# Altium project Sonar_Rev2.PrjPCB
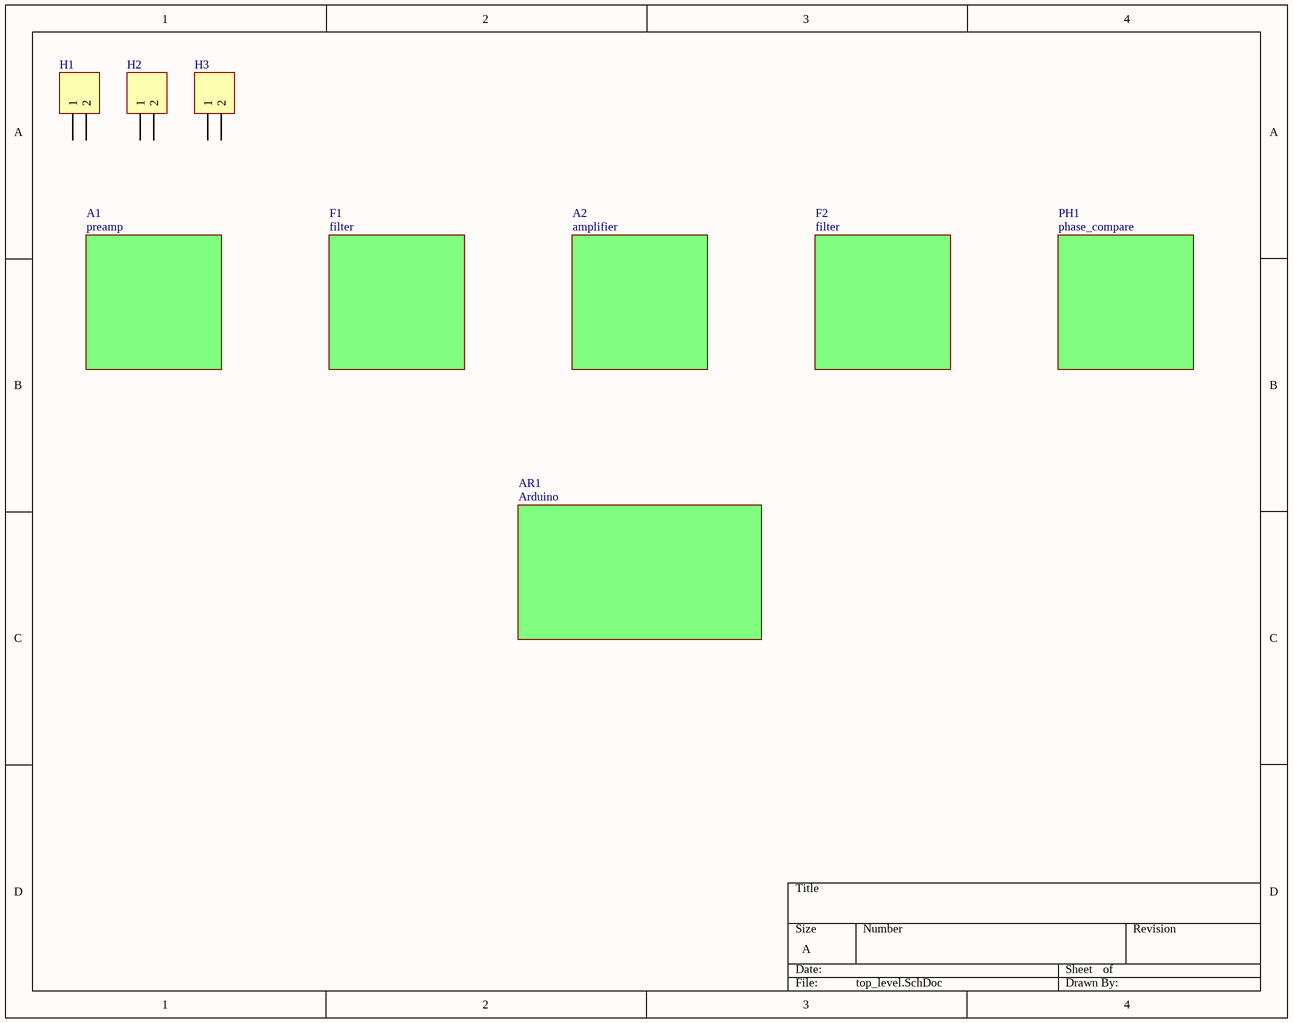
[diagram p0: top_level.SchDoc]
6 sheets, 19 parts. Net scope: global (net labels, ports and power ports of the same name join across sheets).
Board file: sonar_rev2.PcbDoc
Sheets:
  top_level.SchDoc
    A1 = preamp.SchDoc
    F1 = filter.SchDoc
    A2 = amplifier.SchDoc
    F2 = filter.SchDoc
    PH1 = phase_compare.SchDoc
    AR1 = Arduino.SchDoc

## Sheet top_level.SchDoc
size A

### Parts
H1  Header 2  [HDR1X2]  (value not drawn)
H2  Header 2  [HDR1X2]  (value not drawn)
H3  Header 2  [HDR1X2]  (value not drawn)

### Sub-sheets
A1 = preamp: no entries
A2 = amplifier: no entries
AR1 = Arduino: no entries
F1 = filter: no entries
F2 = filter: no entries
PH1 = phase_compare: no entries

### Nets

Not connected (* = marked no-connect by the designer): H1 1 2; H2 1 2; H3 1 2

### Library data of the parts
H1-H3 = Header 2: Header, 2-Pin; LatestRevisionDate: 17-Jul-2002; LatestRevisionNote: Re-released for DXP Platform.; Publisher: Altium Limited

## Sheet preamp.SchDoc
size A
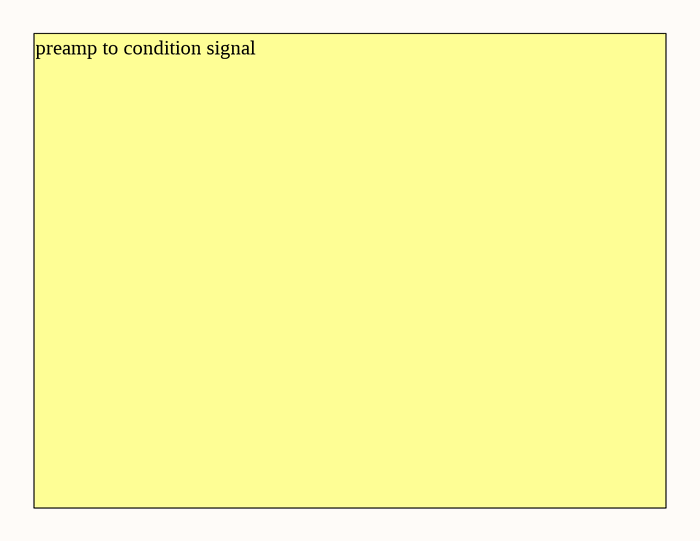
[diagram p1: preamp.SchDoc]

### Notes on the sheet
- preamp to condition signal

## Sheet filter.SchDoc
size A
Used 2 times, as channels F1, F2. Parts and nets are listed once, with the designators drawn on the sheet.
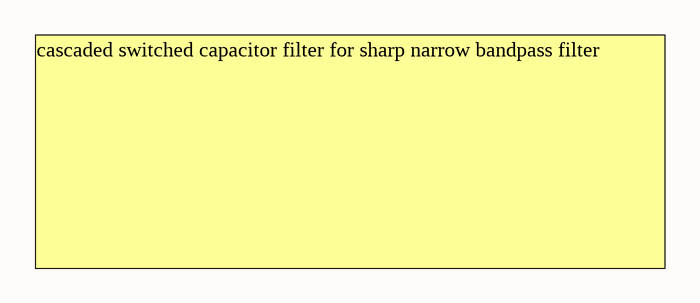
[diagram p2: filter.SchDoc]

### Channels
F1: no parts or ports
F2: no parts or ports

### Notes on the sheet
- cascaded switched capacitor filter for sharp narrow bandpass filter

## Sheet amplifier.SchDoc
size A
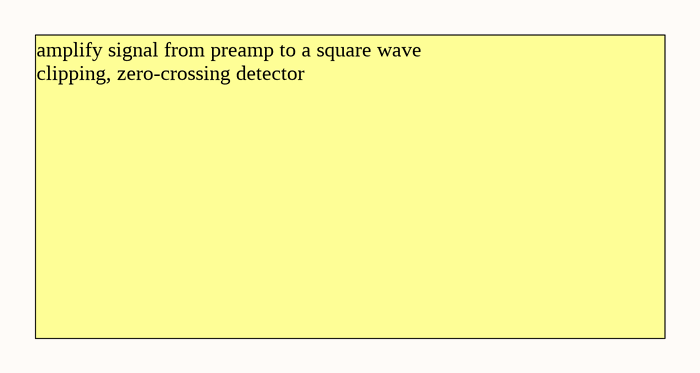
[diagram p3: amplifier.SchDoc]

### Notes on the sheet
- amplify signal from preamp to a square wave
  clipping, zero-crossing detector

## Sheet phase_compare.SchDoc
size A
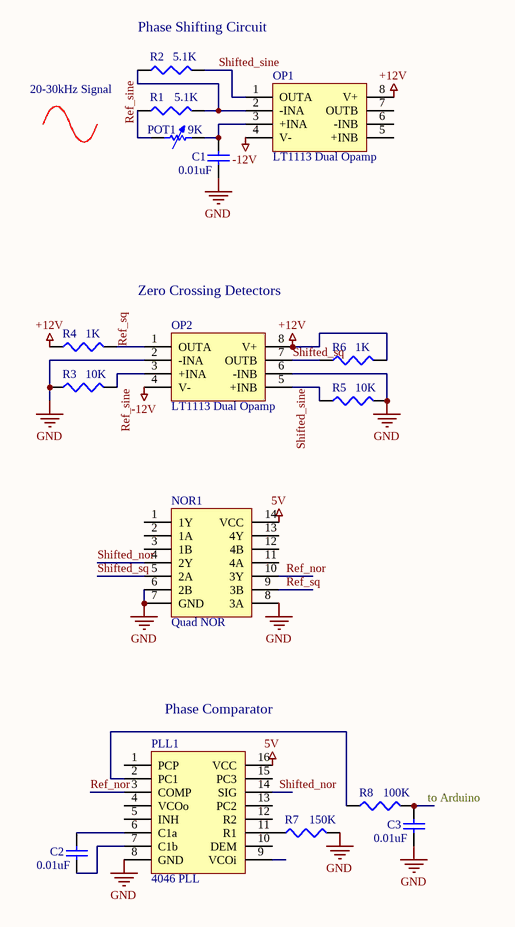
[diagram p4: phase_compare.SchDoc]

### Parts
C1  value 0.01uF  [C1206]  (hidden comment: Cap Semi)
C2  value 0.01uF  [C1206]  (hidden comment: Cap Semi)
C3  value 0.01uF  [C1206]  (hidden comment: Cap Semi)
NOR1  Quad NOR
OP1  LT1113 Dual Opamp
OP2  LT1113 Dual Opamp
PLL1  4046 PLL  [4046PLL]
POT1  value 9K  [AXIAL-0.7]  (hidden comment: Res Adj1)
R1  value 5.1K  [J1-0603]  (hidden comment: Res3)
R2  value 5.1K  [J1-0603]  (hidden comment: Res3)
R3  value 10K  [J1-0603]  (hidden comment: Res3)
R4  value 1K  [J1-0603]  (hidden comment: Res3)
R5  value 10K  [J1-0603]  (hidden comment: Res3)
R6  value 1K  [J1-0603]  (hidden comment: Res3)
R7  value 150K  [J1-0603]  (hidden comment: Res3)
R8  value 100K  [J1-0603]  (hidden comment: Res3)

### Nets
5V: NOR1.14(VCC) PLL1.16(VCC)
+12V: OP1.8(V+) OP2.8(V+) R4.1 R6.2
-12V: OP1.4(V-) OP2.4(V-)
GND: C1.1 C3.1 NOR1.6(2B) NOR1.7(GND) NOR1.8(3A) OP2.2(-INA) OP2.6(-INB) PLL1.8(GND) R3.1 R5.2 R7.2
Ref_nor: NOR1.10(3Y) PLL1.3(COMP)
Ref_sine: OP2.3(+INA) POT1.1 R1.1 R3.2
Ref_sq: NOR1.9(3B) OP2.1(OUTA) R4.2
Shifted_nor: NOR1.4(2Y) PLL1.14(SIG)
Shifted_sine: OP1.1(OUTA) OP2.5(+INB) R2.2 R5.1
Shifted_sq: NOR1.5(2A) OP2.7(OUTB) R6.1
NetC1_2: C1.2 OP1.3(+INA) POT1.2
NetC2_1: C2.1 PLL1.7(C1b)
NetC2_2: C2.2 PLL1.6(C1a)
NetC3_2: C3.2 R8.2
NetOP1_2: OP1.2(-INA) R1.2 R2.1
NetPLL1_2: PLL1.2(PC1) R8.1
NetPLL1_11: PLL1.11(R1) R7.1

Not connected (* = marked no-connect by the designer): NOR1 1(1Y) 2(1A) 3(1B) 11(4A) 12(4B) 13(4Y); OP1 5(+INB) 6(-INB) 7(OUTB); PLL1 1(PCP) 4(VCOo) 5(INH) 9(VCOi) 10(DEM) 12(R2) 13(PC2) 15(PC3)

### Notes on the sheet
- (near R2) Phase Shifting Circuit
- 20-30kHz Signal
- Zero Crossing Detectors
- (near PLL1) Phase Comparator
- to Arduino

### Library data of the parts
C1-C3 = Cap Semi: Capacitor (Semiconductor SIM Model); Published: 8-Jun-2000; LatestRevisionDate: 17-Jul-2002; LatestRevisionNote: Re-released for DXP Platform.; PackageReference: C1206; Publisher: Altium Limited
NOR1 = Quad NOR: HD74HC02
OP1 OP2 = LT1113 OPAMP
PLL1 = 4046 PLL: CD74HC4046A
POT1 = Res Adj1: Variable Resistor; Set Position: 0.5; Published: 8-Jun-2000; LatestRevisionDate: 17-Jul-2002; LatestRevisionNote: Re-released for DXP Platform.; PackageReference: AXIAL-0.7; Publisher: Altium Limited
R1-R8 = Res3: Resistor; Published: 8-Jun-2000; LatestRevisionDate: 04-Mar-2005; LatestRevisionNote: PCB Footprint replaced.; PackageReference: J1-0603; Publisher: Altium Limited

## Sheet Arduino.SchDoc
size A
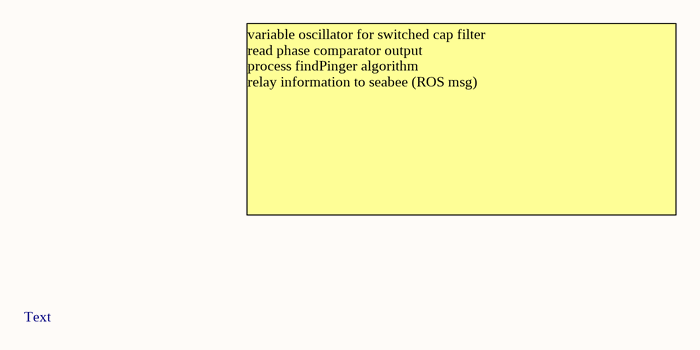
[diagram p5: Arduino.SchDoc]

### Notes on the sheet
- variable oscillator for switched cap filter
  read phase comparator output
  process findPinger algorithm
  relay information to seabee (ROS msg)
- Text